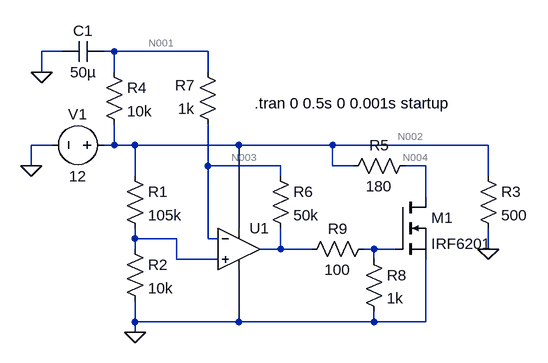
[diagram p0: schematic turn on delay.asc]
turn on delay.asc, the LTspice schematic file:
Version 4
SHEET 1 880 680
WIRE -64 -48 -96 -48
WIRE 16 -48 0 -48
WIRE 160 -48 16 -48
WIRE -96 -16 -96 -48
WIRE 16 -16 16 -48
WIRE 160 -16 160 -48
WIRE -80 96 -112 96
WIRE 16 96 16 64
WIRE 16 96 0 96
WIRE 48 96 16 96
WIRE 208 96 48 96
WIRE 352 96 208 96
WIRE 592 96 352 96
WIRE -112 128 -112 96
WIRE 160 128 160 64
WIRE 272 128 160 128
WIRE 352 128 352 96
WIRE 384 128 352 128
WIRE 496 128 464 128
WIRE 48 144 48 96
WIRE 272 144 272 128
WIRE 592 144 592 96
WIRE 496 176 496 128
WIRE 208 224 208 96
WIRE 48 240 48 224
WIRE 112 240 48 240
WIRE 160 240 160 128
WIRE 176 240 160 240
WIRE 48 256 48 240
WIRE 272 256 272 224
WIRE 272 256 240 256
WIRE 320 256 272 256
WIRE 416 256 400 256
WIRE 448 256 416 256
WIRE 592 256 592 224
WIRE 112 272 112 240
WIRE 176 272 112 272
WIRE 416 272 416 256
WIRE 48 368 48 336
WIRE 208 368 208 288
WIRE 208 368 48 368
WIRE 416 368 416 352
WIRE 416 368 208 368
WIRE 496 368 496 272
WIRE 496 368 416 368
WIRE 48 384 48 368
FLAG -112 128 0
FLAG 592 256 0
FLAG 48 384 0
FLAG -96 -16 0
SYMBOL voltage 16 96 R90
WINDOW 0 -32 56 VBottom 2
WINDOW 3 32 56 VTop 2
WINDOW 123 0 0 Left 2
WINDOW 39 0 0 Left 2
SYMATTR InstName V1
SYMATTR Value 12
SYMBOL res 32 128 R0
SYMATTR InstName R1
SYMATTR Value 105k
SYMBOL res 32 240 R0
SYMATTR InstName R2
SYMATTR Value 10k
SYMBOL Opamps\\UniversalOpamp2 208 256 R0
SYMATTR InstName U1
SYMBOL res 576 128 R0
SYMATTR InstName R3
SYMATTR Value 500
SYMBOL cap 0 -64 R90
WINDOW 0 0 32 VBottom 2
WINDOW 3 32 32 VTop 2
SYMATTR InstName C1
SYMATTR Value 50µ
SYMBOL res 0 -32 R0
SYMATTR InstName R4
SYMATTR Value 10k
SYMBOL res 480 112 R90
WINDOW 0 0 56 VBottom 2
WINDOW 3 32 56 VTop 2
SYMATTR InstName R5
SYMATTR Value 180
SYMBOL res 256 128 R0
SYMATTR InstName R6
SYMATTR Value 50k
SYMBOL res 176 80 R180
WINDOW 0 36 76 Left 2
WINDOW 3 36 40 Left 2
SYMATTR InstName R7
SYMATTR Value 1k
SYMBOL res 400 256 R0
SYMATTR InstName R8
SYMATTR Value 1k
SYMBOL res 416 240 R90
WINDOW 0 0 56 VBottom 2
WINDOW 3 32 56 VTop 2
SYMATTR InstName R9
SYMATTR Value 100
SYMBOL nmos 448 176 R0
SYMATTR InstName M1
SYMATTR Value IRF6201
TEXT 232 32 Left 2 !.tran 0 0.5s 0 0.001s startup

The netlist it stands for:
* turn on delay.asc
V1 N002 0 12
R1 N002 N005 105k
R2 N005 0 10k
XU1 N005 N003 N002 0 N006 level.2 Avol=1Meg GBW=10Meg Slew=10Meg ilimit=25m rail=0 Vos=0 phimargin=45 en=0 enk=0 in=0 ink=0 Rin=500Meg  ; pins IN+ IN- V+ V- OUT
R3 N002 0 500
C1 N001 0 50µ
R4 N001 N002 10k
R5 N004 N002 180
R6 N003 N006 50k
R7 N003 N001 1k
R8 N007 0 1k
R9 N007 N006 100
M1 N004 N007 0 0 IRF6201
.model NMOS NMOS
.model PMOS PMOS
.lib standard.mos
.tran 0 0.5s 0 0.001s startup
.lib UniversalOpamps2.sub
.backanno
.end

* Results of the author's LTspice run, read from the files saved beside the schematic
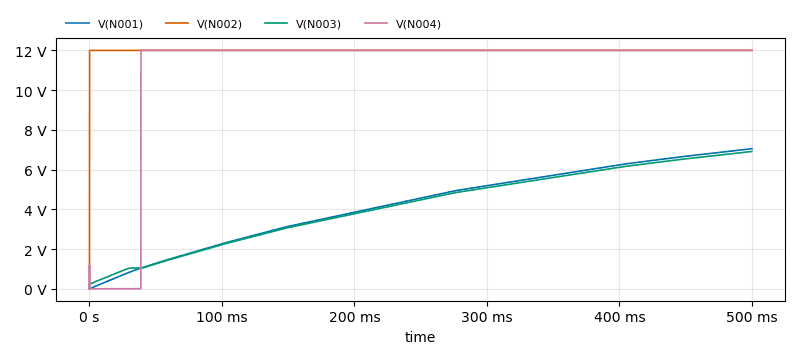
[diagram p1: Transient Analysis of turn on delay.asc, plotted from the saved traces]
* Transient Analysis, 1 run:
*   V(N001): min 0 V, max 7.05 V, average 4.251 V, rms 4.711 V, last 7.05 V
*   V(N002): min 0 V, max 12 V, average 12 V, rms 12 V, last 12 V
*   V(N003): min 0 V, max 6.912 V, average 4.184 V, rms 4.621 V, last 6.912 V
*   V(N004): min 0 V, max 12 V, average 11.07 V, rms 11.52 V, last 12 V